# Altium schematic sheet amp.SchDoc
size A4
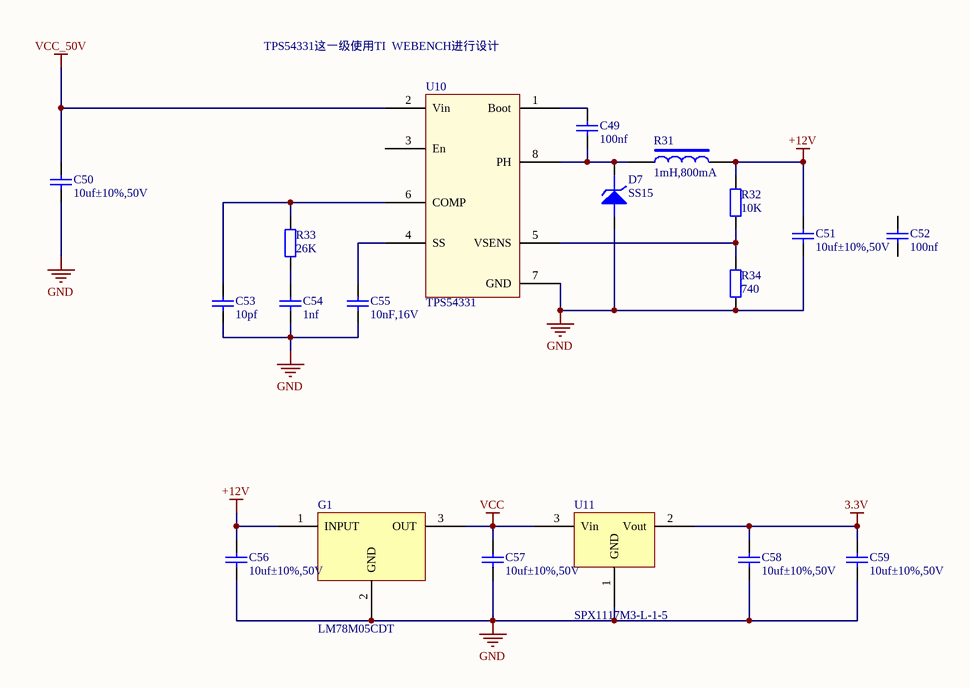
[diagram p0: amp.SchDoc]

## Parts
C49  100nf  [0603]
C50  10uf±10%,50V  [1206]
C51  10uf±10%,50V  [1206]
C52  100nf  [0603]
C53  10pf  [0603]
C54  1nf  [0603]
C55  10nF,16V  [0603]
C56  10uf±10%,50V  [1206]
C57  10uf±10%,50V  [1206]
C58  10uf±10%,50V  [1206]
C59  10uf±10%,50V  [1206]
D7  SS15  [SMA]
G1  LM78M05CDT  [TO-252]
R31  1mH,800mA  [0603_induct]
R32  10K  [0603]
R33  26K  [0603]
R34  740  [0603]
U10  TPS54331  [SOIC-8]
U11  SPX1117M3-L-1-5  [SOT-223]

## Nets
3.3V: C58.2 C59.2 U11.2(Vout)
+12V: C51.2 C56.2 G1.1(INPUT) R31.2 R32.2
GND: C50.1 C51.1 C53.1 C54.1 C55.1 C56.1 C57.1 C58.1 C59.1 D7.1(A) G1.2(GND) R34.1 U10.7(GND) U11.1(GND)
VCC: C57.2 G1.3(OUT) U11.3(Vin)
VCC_50V: C50.2 U10.2(Vin)
NetC49_1: C49.1 D7.2(K) R31.1 U10.8(PH)
NetC49_2: C49.2 U10.1(Boot)
NetC53_2: C53.2 R33.2 U10.6(COMP)
NetC54_2: C54.2 R33.1
NetC55_2: C55.2 U10.4(SS)
NetR32_1: R32.1 R34.2 U10.5(VSENS)

Not connected (* = marked no-connect by the designer): C52 1 2; U10 3(En)

## Notes on the sheet
- TPS54331这一级使用TI  WEBENCH进行设计

## Library data of the parts
C49 C52-C55 = 贴片电容,0603,10nF±10%,16V: 贴片电容; 物料代码: 1.02.15.0010302000
C50 C51 C56-C59 = 贴片电容,1206,10uf±10%,50V: 贴片电容; 物料代码: 1.02.15.0010606010
D7 = 肖特基二极管,SS15,50V,1A,SMA: 肖特基二极管; 物料代码: 1.03.01.0150000000
G1 = 电压转换器,LM78M05CDT,TO-252: 电压转换器; 物料代码: 1.04.08.0780500000
R31 = 1mH,800mA,0810: 贴片电感; 物料代码: 1.05.01.0100000000
R32-R34 = 6.2K±1%,1/10W,0603: 贴片电阻; 物料代码: 1.01.11.6201010000
U10 = TPS54331-sop8
U11 = 电压转换器,SPX1117M3-L-1-5,SOT-223,环保: 电压转换器; 物料代码: 1.04.11.0111731011